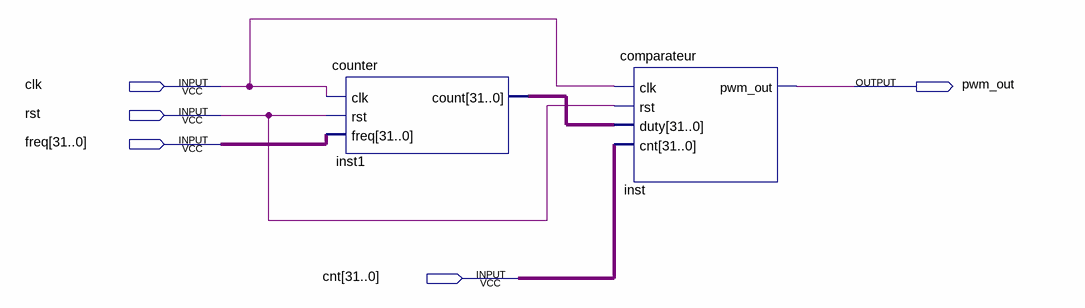
[diagram p0: schematic sheet]
// Quartus schematic PWM.bdf as structural Verilog: 2 symbols, 5 pins
module PWM (
  input  clk,
  input  rst,
  input  [31:0] freq,
  input  [31:0] cnt,
  output pwm_out
);

  wire [31:0] inst1_count;

  counter inst1 (.clk(clk), .rst(rst), .freq(freq), .count(inst1_count));
  comparateur inst (.clk(clk), .rst(rst), .duty(inst1_count), .cnt(cnt), .pwm_out(pwm_out));
endmodule
